# Altium schematic sheet Connectors_General.SchDoc
size A4; SheetNumber: 3; SheetTotal: 6
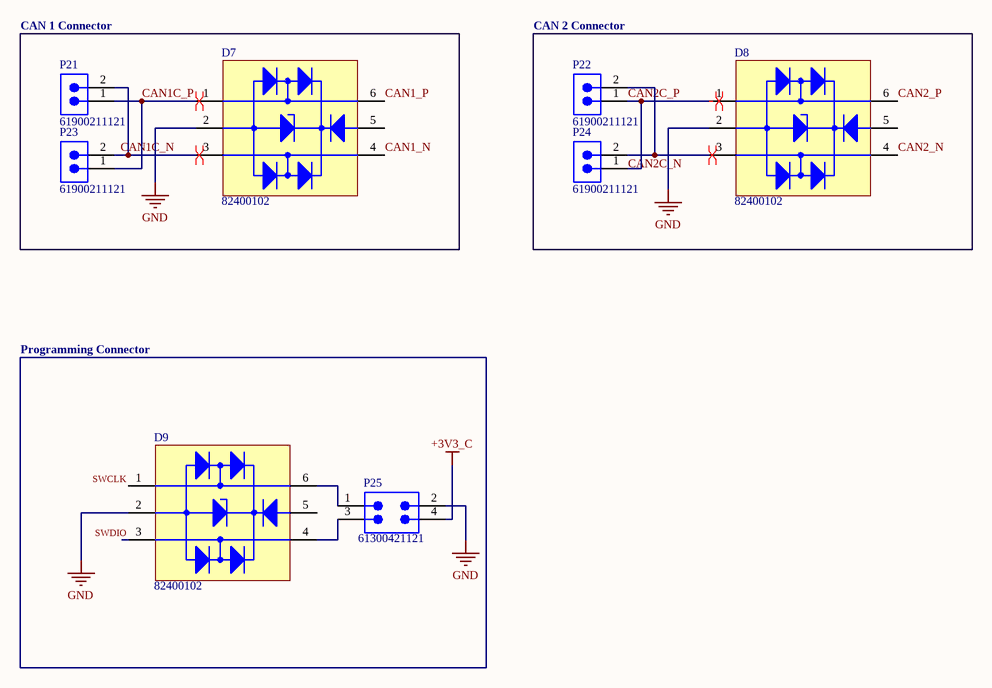
[diagram p0: Connectors_General.SchDoc]

## Parts
D7  82400102  [WE-TVS_SOT23-6L]
D8  82400102  [WE-TVS_SOT23-6L]
D9  82400102  [WE-TVS_SOT23-6L]
P21  61900211121  [61900211121]
P22  61900211121  [61900211121]
P23  61900211121  [61900211121]
P24  61900211121  [61900211121]
P25  61300421121  [61300421121]

## Blocks framed on the sheet
CAN 1 Connector: D7 P21 P23
CAN 2 Connector: D8 P22 P24
Programming Connector: D9 P25

## Nets
+3V3_C: P25.4
GND: D7.2(GND) D8.2(GND) D9.2(GND) P25.2
CAN1_N: D7.4(I/O_2)
CAN1_P: D7.6(I/O_1)
CAN1C_N: D7.3(I/O_2) P21.2 P23.2
CAN1C_P: D7.1(I/O_1) P21.1 P23.1
CAN2_N: D8.4(I/O_2)
CAN2_P: D8.6(I/O_1)
CAN2C_N: D8.3(I/O_2) P22.2 P24.2
CAN2C_P: D8.1(I/O_1) P22.1 P24.1
SWCLK: D9.1(I/O_1)
SWDIO: D9.3(I/O_2)
NetD9_4: D9.4(I/O_2) P25.3
NetD9_6: D9.6(I/O_1) P25.1

Not connected (* = marked no-connect by the designer): D7 5(VDD); D8 5(VDD); D9 5(VDD)

## Layout directives
differential pair: CAN1C_N, CAN1C_P, CAN2C_N, CAN2C_P

## Library data of the parts
D7-D9 = CMP-004-00017-1: WE-TVS TVS Diode – High Speed Series, SOT23-6L, 2+1 Channel, 5V, 2pF; Manufacturer: Wurth Elektronik; Polarity: Unidirectional; Channel ESD Clamping Voltage: 10V; ESD Air Discharge Capability: 15kV; (Reverse) Peak Pulse Current: 7A; (Reverse) Breakdown Voltage: 6V; Channel Reverse Leakage Current: 1uA; ESD Contact Discharge Capability: 8kV; Source: WE-TVS.SchLib; Component Type: Standard; Packaging: Tape and Reel; Height: 1.45mm; Pins: 6; Match Code: WE-TVS; Case/Package: SOT23-6L; Mount: Surface Mount; Channel Operating Voltage: 5V; ComponentLink1Description: Website Link; ComponentLink2URL: https://www.we-online.com/redexpert/spec/82400102?ad; Category: ESD Protection; Channel Input Capacitance: 2pF; Operating Temperature Min: -40°C; ComponentLink1URL: https://www.we-online.com/redexpert/article/82400102?ad; Length: 2.9mm; Width: 2.8mm; Manufacturer Part Number: 82400102; Design Item ID: 82400102; ComponentLink2Description: Datasheet Link; Operating Temperature Max: 125°C; Number of Channels: 2+1
P21-P24 = CMP-002-00287-1: WR-WTB THT Male Vertical Locking Header, pitch 2.54mm, 2pins; Manufacturer: Wurth Elektronik; Withstanding Voltage: 1000VAC; Rated Current: 3A; Working Voltage: 250VAC; Contact Resistance: 20mOhm; Match Code: WR-WTB; Height: 11.5mm; Pin Count: 2; Pitch: 2.54mm; Category: Wire-to-Board Connectors; Orientation: Vertical; Length: 5.08mm; ComponentLink1Description: Website Link; Manufacturer Part Number: 61900211121; Operating Temperature Max: 105°C; Component Type: Standard; Source: WR-WTB.SchLib; Width: 5.8mm; ComponentLink1URL: https://www.we-online.com/redexpert/article/61900211121?ad; Packaging: Bag; ComponentLink2URL: https://www.we-online.com/redexpert/spec/61900211121?ad; Number of Rows: 1; Pins: 2; Design Item ID: 61900211121; Operating Temperature Min: -40°C; Gender: Male; ComponentLink2Description: Datasheet Link; Mount: Through Hole
P25 = CMP-002-00747-2: Board Connector, 4 Contact(s), 2 Row(s), Male, Straight, 0.1 inch Pitch, Solder Terminal, Black Insulator, Plug; RoHS Compliant: Yes; Min Operating Temperature: -40°C; Mounting Technology: Board; Connector Type: BOARD CONNECTOR; Max Operating Temperature: 125°C